# EAGLE design radio (EAGLE 7.1.0)
Raspberry Pi Add-on: Radio
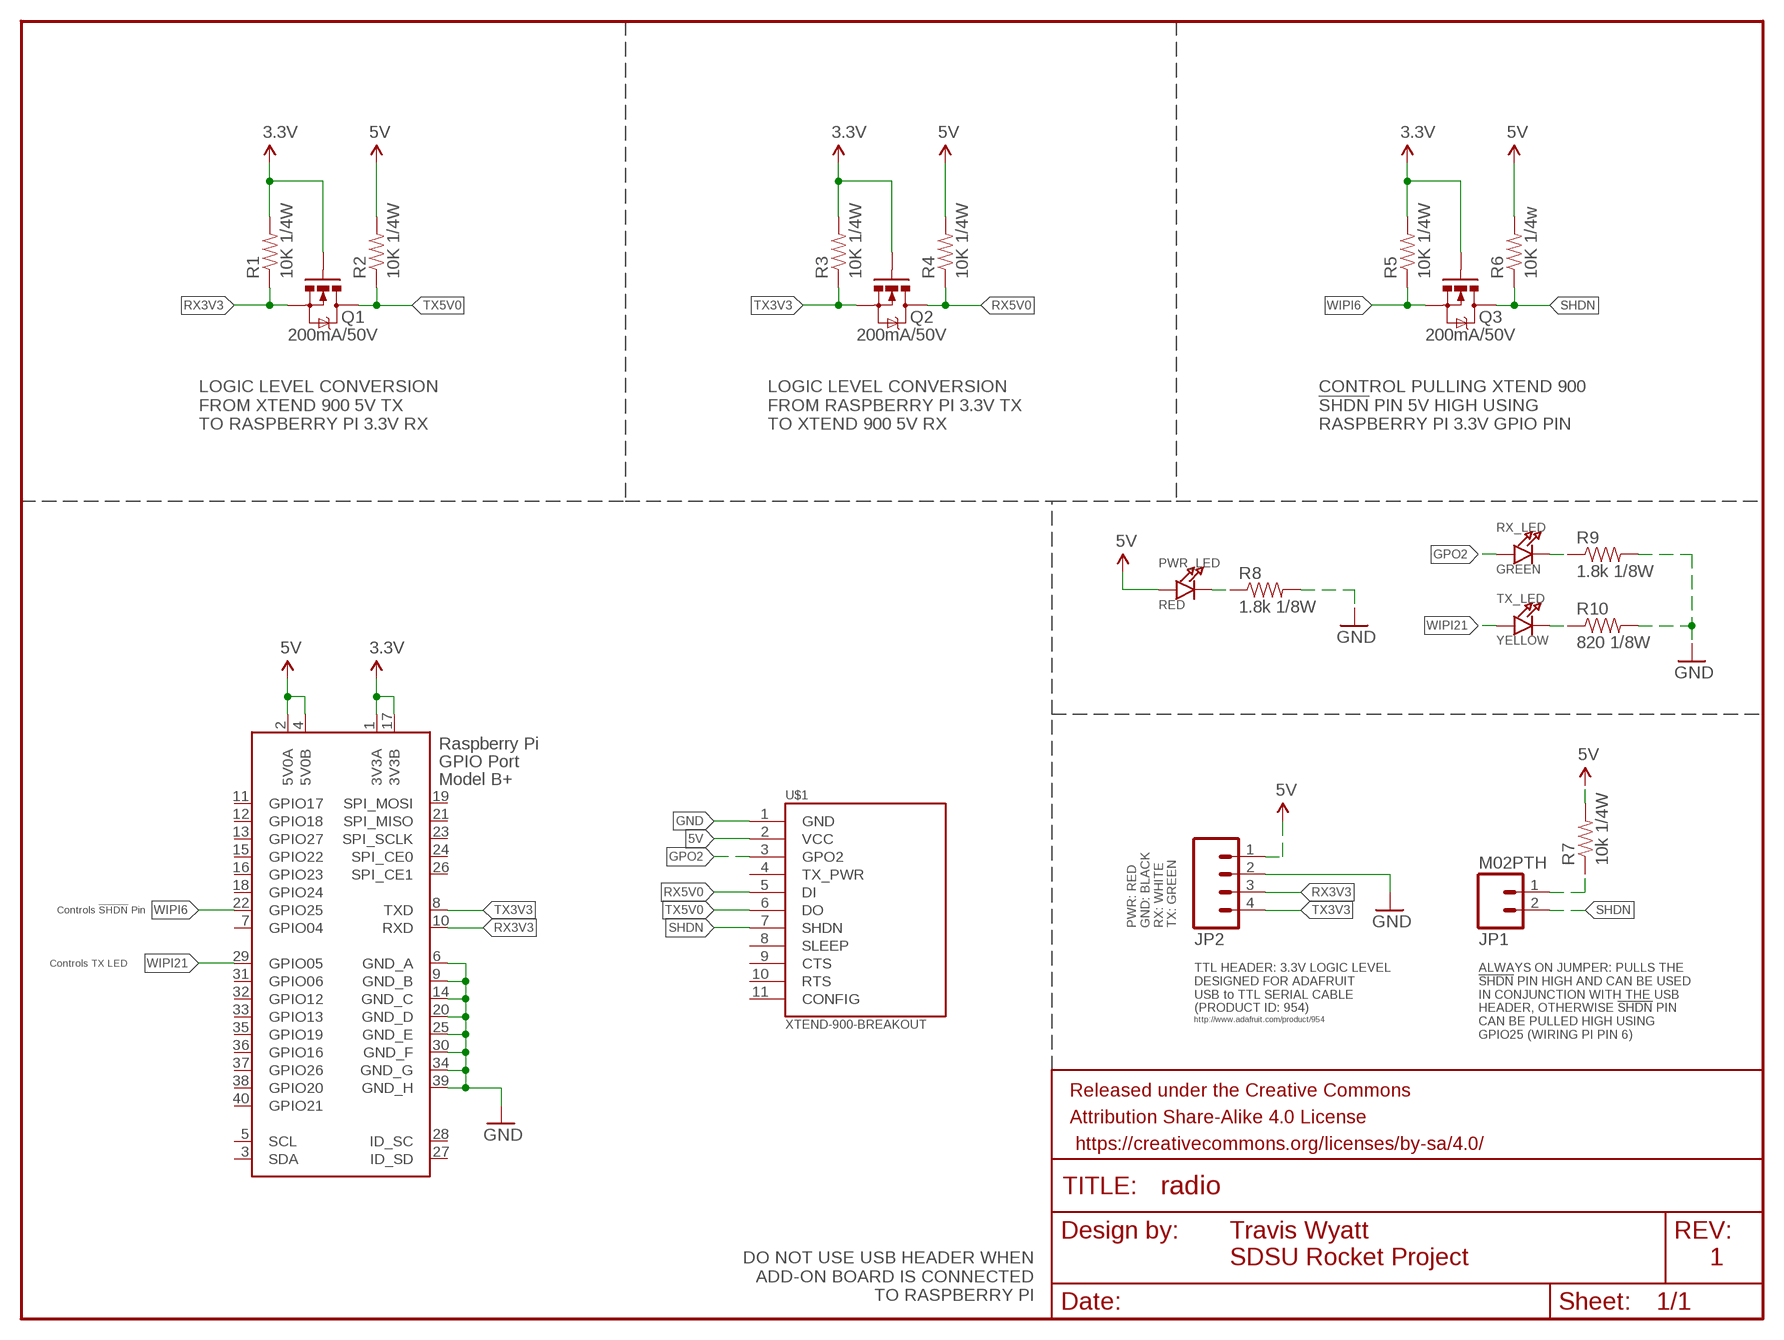
[diagram p0: schematic, sheet 1]

## Parts
FRAME1  FRAME-LETTER  [CREATIVE_COMMONS]
JP1  M02PTH  [1X02]
JP2  M04PTH  [1X04]
PWR_LED  RED  LED0603  [CHIPLED_0603]
Q1  200mA/50V  MOSFET-NCHANNELBSS138  [SOT23-3]
Q2  200mA/50V  MOSFET-NCHANNELBSS138  [SOT23-3]
Q3  200mA/50V  MOSFET-NCHANNELBSS138  [SOT23-3]
R1  10K 1/4W  RESISTOR0603-RES  [0603-RES]
R2  10K 1/4W  RESISTOR0603-RES  [0603-RES]
R3  10K 1/4W  RESISTOR0603-RES  [0603-RES]
R4  10K 1/4W  RESISTOR0603-RES  [0603-RES]
R5  10K 1/4W  RESISTOR0603-RES  [0603-RES]
R6  10K 1/4w  RESISTOR0603-RES  [0603-RES]
R7  10k 1/4W  RESISTOR0603-RES  [0603-RES]
R8  1.8k 1/8W  RESISTOR0603-RES  [0603-RES]
R9  1.8k 1/8W  RESISTOR0603-RES  [0603-RES]
R10  820 1/8W  RESISTOR0603-RES  [0603-RES]
RX_LED  GREEN  LED0603  [CHIPLED_0603]
TX_LED  YELLOW  LED0603  [CHIPLED_0603]
U$1  XTEND-900-BREAKOUT  [XTEND-900]
X1  RASPI_BOARD_B+#_H  [RASPI_BOARD_B+HAT]

## Nets
3.3V: Q1.1(G) Q2.1(G) Q3.1(G) R1.2 R3.2 R5.2 X1.1(3V3A) X1.17(3V3B)
5V [5V Power]: JP2.1 PWR_LED.A R2.2 R4.2 R6.2 R7.2 U$1.2(VCC) X1.2(5V0A) X1.4(5V0B)
GND: JP2.2 R8.2 R9.2 R10.2 U$1.1(GND) X1.6(GND_A) X1.9(GND_B) X1.14(GND_C) X1.20(GND_D) X1.25(GND_E) X1.30(GND_F) X1.34(GND_G) X1.39(GND_H)
GPO2: RX_LED.A U$1.3(GPO2)
N$4: JP1.1 R7.1
N$5: PWR_LED.C R8.1
N$8: R9.1 RX_LED.C
N$11: R10.1 TX_LED.C
RX3V3: JP2.3 Q1.2(S) R1.1 X1.10(RXD)
RX5V0: Q2.3(D) R4.1 U$1.5(DI)
SHDN: JP1.2 Q3.3(D) R6.1 U$1.7(SHDN)
TX3V3: JP2.4 Q2.2(S) R3.1 X1.8(TXD)
TX5V0: Q1.3(D) R2.1 U$1.6(DO)
WIPI6: Q3.2(S) R5.1 X1.22(GPIO25)
WIPI21: TX_LED.A X1.29(GPIO05)
Unconnected: U$1.4(TX_PWR) U$1.8(SLEEP) U$1.9(CTS) U$1.10(RTS) U$1.11(CONFIG) X1.3(SDA) X1.5(SCL) X1.7(GPIO04) X1.11(GPIO17) X1.12(GPIO18) X1.13(GPIO27) X1.15(GPIO22) X1.16(GPIO23) X1.18(GPIO24) X1.19(SPI_MOSI) X1.21(SPI_MISO) X1.23(SPI_SCLK) X1.24(SPI_CE0) X1.26(SPI_CE1) X1.27(ID_SD) X1.28(ID_SC) X1.31(GPIO06) X1.32(GPIO12) X1.33(GPIO13) X1.35(GPIO19) X1.36(GPIO16) X1.37(GPIO26) X1.38(GPIO20) X1.40(GPIO21)

## Notes on the sheet
- LOGIC LEVEL CONVERSION
  FROM XTEND 900 5V TX
  TO RASPBERRY PI 3.3V RX
- LOGIC LEVEL CONVERSION
  FROM RASPBERRY PI 3.3V TX
  TO XTEND 900 5V RX
- CONTROL PULLING XTEND 900
  !SHDN! PIN 5V HIGH USING
  RASPBERRY PI 3.3V GPIO PIN
- Controls !SHDN! Pin
- PWR: RED
  GND: BLACK
  RX: WHITE
  TX: GREEN
- Controls TX LED
- TTL HEADER: 3.3V LOGIC LEVEL
  DESIGNED FOR ADAFRUIT
  USB to TTL SERIAL CABLE
  (PRODUCT ID: 954)
- ALWAYS ON JUMPER: PULLS THE
  !SHDN! PIN HIGH AND CAN BE USED
  IN CONJUNCTION WITH THE USB
  HEADER, OTHERWISE !SHDN! PIN
  CAN BE PULLED HIGH USING
  GPIO25 (WIRING PI PIN 6)
- http://www.adafruit.com/product/954
- Travis Wyatt
- SDSU Rocket Project
- 1
- DO NOT USE USB HEADER WHEN
  ADD-ON BOARD IS CONNECTED
  TO RASPBERRY PI

## Library data of the parts
FRAME1 = SparkFun-Aesthetics:FRAME-LETTER: Schematic Frame Standard 8.5x11 US Letter frame; DESIGNER: NAME; VERSION: v01
JP1 = SparkFun-Connectors:M02: Standard 2-pin 0.1" header. Use with - straight break away headers ( PRT-00116) - right angle break away headers (PRT-00553) - swiss pins (PRT-00743) - machine pins (PRT-00117) - female headers (PRT-00115) Molex polarized connector foot print use with: PRT-08233 with associated crimp pins and housings. 2.54_SCREWTERM for use with PRT-10571. 3.5mm Screw Terminal footprints for PRT-08084 5mm Screw Terminal footprints for use with PRT-08432
JP2 = SparkFun-Connectors:M04: Header 4 Standard 4-pin 0.1" header. Use with straight break away headers (SKU : PRT-00116), right angle break away headers (PRT-00553), swiss pins (PRT-00743), machine pins (PRT-00117), and female headers (PRT-00115). Molex polarized connector foot print use with SKU : PRT-08231 with associated crimp pins and housings. 1MM SMD Version SKU: PRT-10208
PWR_LED RX_LED TX_LED = microbuilder_v2:LED: LED 0603 - 0603 Surface Mount Package 2mA: Green LED - Low Power (3.9mcd, 2ma, 1.7Vf) - Digikey: 475-2709-2-ND Orange LED - Low Power (9.8mcd, 2ma, 1.8Vf) - Digikey: 475-1194-2-ND Red LED - Low Power (5mcd, 2ma, 1.8Vf) - Digikey: 475-1195-2-ND Yellow LED - Low Power (7mcd, 2ma, 1.8Vf) - Digikey: 475-1196-2-ND 5mA: Blue LED - Low Power (17mcd, 5ma, 2.9Vf) - Digikey: LNJ937W8CRACT-ND 0805 - 0805 Surface Mount Package 2mA: Red LED (8.8mcd, 2mA, 1.8Vf, Clear) - Low Power [Digikey: 475-2510-1-ND] Green LED (5mcd, 2mA, 1.8Vf, Clear) - Low Power [Digikey: 475-2730-1-ND] Yellow LED (11.3mcd, 2mA, 1.8Vf, Clear) - Low Power [Digikey: 475-2555-1-ND] 20mA: Red LED (104mcd, 20mA, Diffused) - LS R976 [Digikey: 475-1278-6-ND] Red LED (12mcd, 20mA, 2.0Vf, Clear) - APT2012EC [Digikey: 754-1128-1-ND] Green LED (15mcd, 20mA, 2.2Vf, Clear) - APT2012GC [Digikey: 754-1131-1-ND] Orange LED (160mcd, 20mA, 2.1Vf, Clear) - APT2012SECK [Digikey: 754-1130-1-ND] 1206 - 1206 Surface Mount Package Green LED (26mcd, 20mA, Diffused) - LG N971 [Digikey: 475-1407-6-ND] Red LED (15mcd, 20mA, Diffused) - LH N974 [Digikey: 475-1416-6-ND]
Q1-Q3 = SparkFun-DiscreteSemi:MOSFET-NCHANNEL: Common NMOSFET Parts MFG P/N Store ID Prod ID FDD8780 TRANS-09984 SI7820DN TRANS-11055 FDS6630A IC-08089 2N7002PW TRANS-11151 FQP30N06L COM-10213 TRANS-10060 BSS123LT1G TRANS-08345 BSS138 TRANS-00830 BS170 2N7000; PROD_ID: TRANS-00830
R1-R10 = SparkFun-Resistors:RESISTOR: Resistor Basic schematic elements and footprints for 0603, 1206, and PTH resistors.
U$1 = SDSURocket-BreakoutBoards:XTEND-900: XTend 900 Header Layout Layout for the XTend 900 Radio. Pins are arranged so the radio can be mounted face down (silver cover) against the PCB. SparkFun Part #: WRL-09411 <https://www.sparkfun.com/products/9411>
X1 = raspberrypi_bastelstube_v13:RASPI_BOARD_B+#: Raspberry Pi GPIO connector with markings for the outer dimensions of the Raspberry Pi board model B+ with different sets of drill holes or mounting pads All pins connected

## Net classes
1 5V Power: width 0.406 mm

## Board
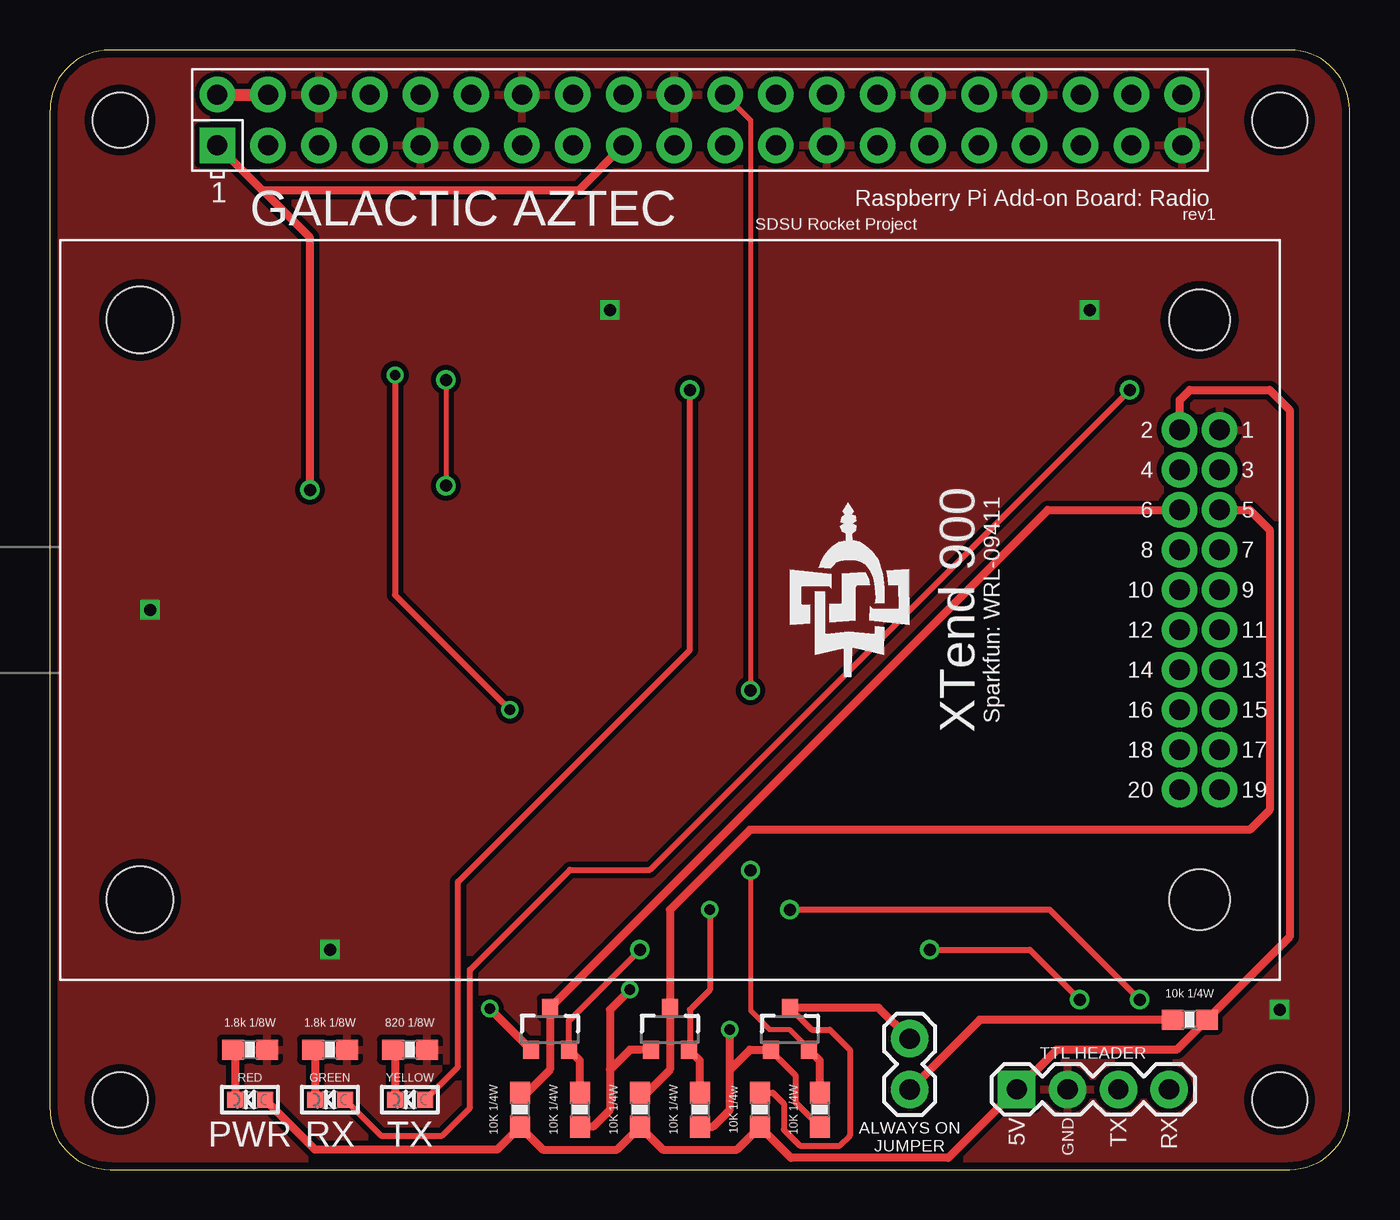
[diagram p1: board, top side]
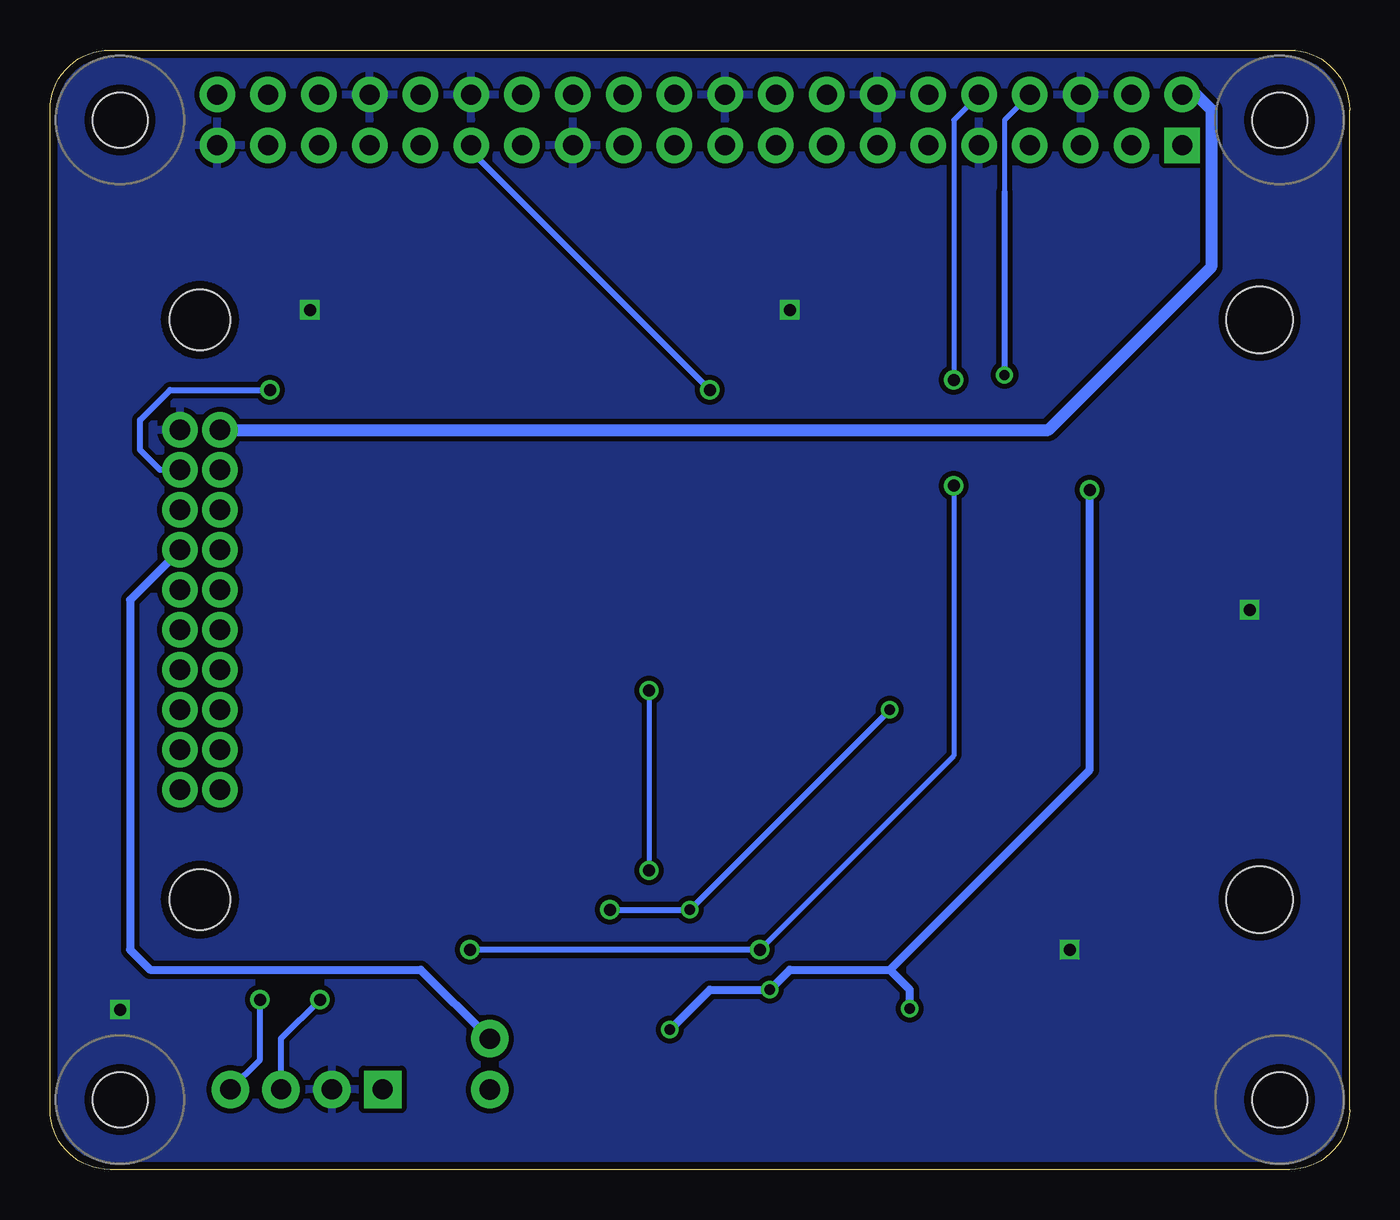
[diagram p2: board, bottom side, seen from below]

Size 65 x 56 mm. Coordinates in mm from the lower left corner, seen from the top.
Copper layers (1*16): Top 0.0356mm / dielectric 1.5011mm / Bottom 0.0356mm
Design rules "SparkFunBestPractices": minimum track width 10mil, minimum drill 13mil, track to track 10mil, track to pad 10mil, pad to pad 10mil, via to via 10mil, smd to smd 10mil, copper to edge 15mil, drill to drill 12mil, minimum pad ring 7mil, minimum via ring 7mil, stop-mask expansion 3mil, vias tented up to drill 0mil, thermal gap 10mil

### Footprints (pad centres in the part's own frame; a part is rotated, then mirrored left to right if it is on the bottom)
1X02 = drill 1.016 pad 1.88: 1 0,0; 2 2.54,0
1X04 = drill 1.016 pad 1.88 square: 1 0,0 | drill 1.016 pad 1.88: 2 2.54,0; 3 5.08,0; 4 7.62,0
CHIPLED_0603 = smd 0.8 x 0.8: A 0,-0.75; C 0,0.75
SOT23-3 = smd 0.8 x 0.9: 1 -0.95,-1; 2 0.95,-1; 3 0,1.1
0603-RES = smd 1.1 x 1: 1 -0.85,0; 2 0.85,0
XTEND-900 = drill 1.016 pad 1.778: 1 9,-27.5; 2 9,-25.5; 3 7,-27.5; 4 7,-25.5; 5 5,-27.5; 6 5,-25.5; 7 3,-27.5; 8 3,-25.5; 9 1,-27.5; 10 1,-25.5; 11 -1,-27.5; 12 -1,-25.5; 13 -3,-27.5; 14 -3,-25.5; 15 -5,-27.5; 16 -5,-25.5; 17 -7,-27.5; 18 -7,-25.5; 19 -9,-27.5; 20 -9,-25.5 | hole 3.048: -14.5,-26.5; 14.5,-26.5 | hole 3.302: -14.5,26.5; 14.5,26.5
RASPI_BOARD_B+HAT = drill 1 pad 1.778 square: 1 8.37,51.23 | drill 1 pad 1.778: 2 8.37,53.77; 3 10.91,51.23; 4 10.91,53.77; 5 13.45,51.23; 6 13.45,53.77; 7 15.99,51.23; 8 15.99,53.77; 9 18.53,51.23; 10 18.53,53.77; 11 21.07,51.23; 12 21.07,53.77; 13 23.61,51.23; 14 23.61,53.77; 15 26.15,51.23; 16 26.15,53.77; 17 28.69,51.23; 18 28.69,53.77; 19 31.23,51.23; 20 31.23,53.77; 21 33.77,51.23; 22 33.77,53.77; 23 36.31,51.23; 24 36.31,53.77; 25 38.85,51.23; 26 38.85,53.77; 27 41.39,51.23; 28 41.39,53.77; 29 43.93,51.23; 30 43.93,53.77; 31 46.47,51.23; 32 46.47,53.77; 33 49.01,51.23; 34 49.01,53.77; 35 51.55,51.23; 36 51.55,53.77; 37 54.09,51.23; 38 54.09,53.77; 39 56.63,51.23; 40 56.63,53.77 | hole 2.75: 3.5,3.5; 3.5,52.5; 61.5,3.5; 61.5,52.5

### Placement (x,y rotation side)
FRAME1  0,-11.43 0 top  (outside the outline)
JP1  43,4 90 top
JP2  48.36,4.01 0 top
PWR_LED  10,3.5 90 top
Q1  25,7 0 top
Q2  31,7 0 top
Q3  37,7 0 top
R1  26.5,3 270 top
R2  23.5,3 270 top
R3  32.5,3 270 top
R4  29.5,3 270 top
R5  38.5,3 270 top
R6  35.5,3 270 top
R7  57,7.5 0 top
R8  10,6 0 top
R9  14,6 0 top
R10  18,6 0 top
RX_LED  14,3.5 90 top
TX_LED  18,3.5 90 top
U$1  31,28 90 top
X1  0,0 0 top

### Tracks (layer width: path | path; a pad name or v marks a point on that pad's centre or on a via)
3.3V  (via drill 0.51, 0.6)
  Top 0.305: Q3.1 36.05,5.95 37.3,4.7 37.3,3.35 R5.2
  Top 0.406: 28,5 28,3 27.15,2.15 R1.2 | X1.17 26.46,49 10.6,49 X1.1 13,46.6 v13,34 | Q2.1 29,6 28,5 | R3.2 33.15,2.15 34,3 34,5 | 34,5 35,6 Q3.1 | 34,5 v34,7 | v29,9 28,8 28,5 | Q1.1 v22,8.05
  Bottom 0.406: v34,7 32,9 v29,9 28,10 23,10 | v22,8.05 22,9 23,10 | 23,10 13,20 v13,34
5V
  Top 0.406: U$1.2 56.5,38.5 57,39 61,39 62,38 62,11.65 R7.2 56.35,6 50.35,6 JP2.1 44.94,0.58 37.06,0.58 R6.2 34.35,1 30.65,1 R4.2 28.35,1 24.65,1 R2.2 22.35,1 13.25,1 PWR_LED.A
  Top 0.61: X1.2 X1.4
  Bottom 0.61: X1.2 7.67,53.77 6.92,53.02 6.92,45.15 15.07,37 U$1.2
GND  (via drill 0.6)
  other vias: 5,28 14,11 28,43 52,43 61.5,8
  pour Bottom: 0,0 0,56 65,56 65,0
  pour Top: 0,0 0,56 65,56 65,0
GPO2  (via drill 0.6)
  Top 0.305: RX_LED.A 16.55,1.7 19.6,1.7 21,3.1 21,10 26,15 30,15 v54,39
  Bottom 0.305: U$1.3 59.5,35 60.5,36 60.5,37.5 59,39 v54,39
N$4
  Top 0.406: R7.1 46.5,7.5 JP1.1
N$5
  Top 0.406: R8.1 9.25,5.9 PWR_LED.C
N$8
  Top 0.406: R9.1 13.25,5.9 RX_LED.C
N$11
  Top 0.406: R10.1 17.25,5.9 TX_LED.C
RX3V3  (via drill 0.6)
  Top 0.254: v19.8,39.5 v19.8,34.2
  Top 0.305: Q1.2 25.95,7.45 v29.5,11 | v44,11 49,11 v51.5,8.5
  Top 0.406: R1.1 26.5,5.45 Q1.2
  Bottom 0.254: X1.10 19.8,52.5 v19.8,39.5 | v29.5,11 19.8,20.7 v19.8,34.2
  Bottom 0.305: v29.5,11 v44,11 | JP2.3 53.44,6.56 v51.5,8.5
RX5V0
  Top 0.406: R4.1 29.85,3.85 31,5 Q2.3 31,13 35,17 60,17 61,18 61,32 60,33 U$1.5
SHDN
  Top 0.305: Q3.3 38.1,7 39,7 40,6 40,1.7 39.49,1.2 37.51,1.2 36.7,2 36.7,3.3 36.15,3.85 R6.1
  Top 0.406: JP1.2 41.44,8.1 Q3.3
  Bottom 0.406: U$1.7 61,28.5 61,11 60,10 46.46,10 JP1.2
TX3V3  (via drill 0.51, 0.6)
  Top 0.305: v33,13 33,9 32,8 32,6.05 Q2.2 | v17.26,39.74 17.26,28.74 v23,23 | v54.5,8.5 50,13 v37,13
  Top 0.406: R3.1 32.5,5.45 Q2.2
  Bottom 0.254: 17.26,48.9 17.26,52.5 X1.8
  Bottom 0.305: 17.26,48.9 v17.26,39.74 | v23,23 v33,13 v37,13 | JP2.4 54.5,5.49 v54.5,8.5
TX5V0
  Top 0.406: U$1.6 49.9,33 Q1.3 25,5 23.85,3.85 R2.1
WIPI6  (via drill 0.6)
  Top 0.254: X1.22 35.04,52.5 v35.04,23.96 | 37.95,6.05 37,7 36,7 35.04,7.96 v35.04,14.96
  Top 0.305: Q3.2 37.95,6.05
  Top 0.406: R5.1 38.5,5.45 Q3.2
  Bottom 0.254: v35.04,23.96 v35.04,14.96
WIPI21  (via drill 0.6)
  Top 0.305: TX_LED.A 20.4,5.15 20.4,14.4 32,26 v32,39
  Bottom 0.305: v32,39 43.93,50.93 X1.29

### Text on the board
tNames: GALACTIC AZTEC | Raspberry Pi Add-on Board: Radio | rev1 | SDSU Rocket Project | TTL HEADER | 5V | GND | TX | RX | PWR | RX | TX | ALWAYS ON / JUMPER